# Altium schematic sheet 12. JTAG.SchDoc
size A4; CheckedBy: 黄钦宁; Author: 陈坤; DocumentNumber: 12; SheetNumber: 12; SheetTotal: 13; PageSetup: Record=PageOptions|CenterHorizontal=True|CenterVertical=True|PrintScale=1.00|XCorrection=1.00|YCorrection=1.00|PrintKind=0|BorderSize=5000000|LeftOffset=0|BottomOffset=0|Orientation=2|PaperLength=1000|PaperWidth=1000|Scale=100|PaperSource=7|PrintQuality=600|MediaType=1|DitherType=10|PaperKind=A4|PrintScaleMode=1; DesignDate: 2013-08-16; CheckDate: 2013-12-28; SheetName: JTAG; SheetVersion: V1.00; SheetDescription: JTAG; ProductName: EasyARM-iMX28学习套件; ProductModel: EasyARM-iMX283
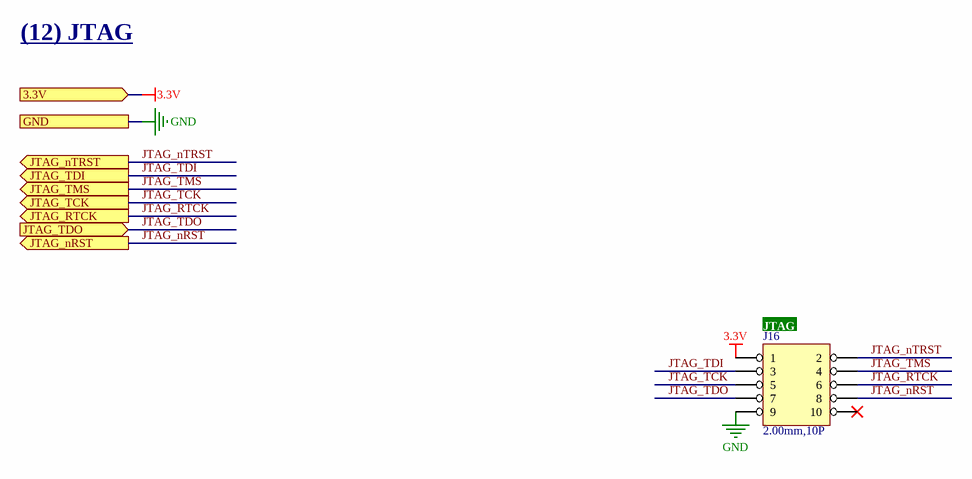
[diagram p0: 12. JTAG.SchDoc]

## Parts
J16  value 2.00mm,10P  [IDE-10-2.0]  (hidden comment: HEADER 5X2)

## Ports
3.3V, GND, JTAG_nRST (out), JTAG_nTRST (out), JTAG_RTCK (out), JTAG_TCK (out), JTAG_TDI (out), JTAG_TDO (in), JTAG_TMS (out)

## Nets
3.3V: J16.1 ; port 3.3V
GND: J16.9 ; port GND
JTAG_nRST: J16.8 ; port JTAG_nRST
JTAG_nTRST: J16.2 ; port JTAG_nTRST
JTAG_RTCK: J16.6 ; port JTAG_RTCK
JTAG_TCK: J16.5 ; port JTAG_TCK
JTAG_TDI: J16.3 ; port JTAG_TDI
JTAG_TDO: J16.7 ; port JTAG_TDO
JTAG_TMS: J16.4 ; port JTAG_TMS

Not connected (* = marked no-connect by the designer): J16 10*

## Notes on the sheet
- (12) JTAG
- (near J16) JTAG
- 1
- #
- 修改日期
- 修改内容
- 2
- 3
- 广州致远电子股份有限公司
- 设计人员
- 审核人员
- 设计日期
- 审核日期
- 产品名称
- 图纸名称
- 产品型号
- 图纸描述
- 图纸版本
- A4

## Library data of the parts
J16 = 1.10.04.0026: 2.00mm,10P,180°,黑色; 名称: 简易牛角座; 贴片和直插: THT; 物料代码: 1.10.04.0026; 型号: 2.00mm,10P,180°,黑色; ComponentLink1Description: ErpDataInfo; ComponentLink1URL: http://erp.zlgmcu.com/ErpExt/ErpData/ListMateriel.aspx?pkey=1.10.04.0026